# Altium schematic sheet 07.RK3399 Display.SchDoc
size A4; SheetNumber: 7; SheetTotal: 10
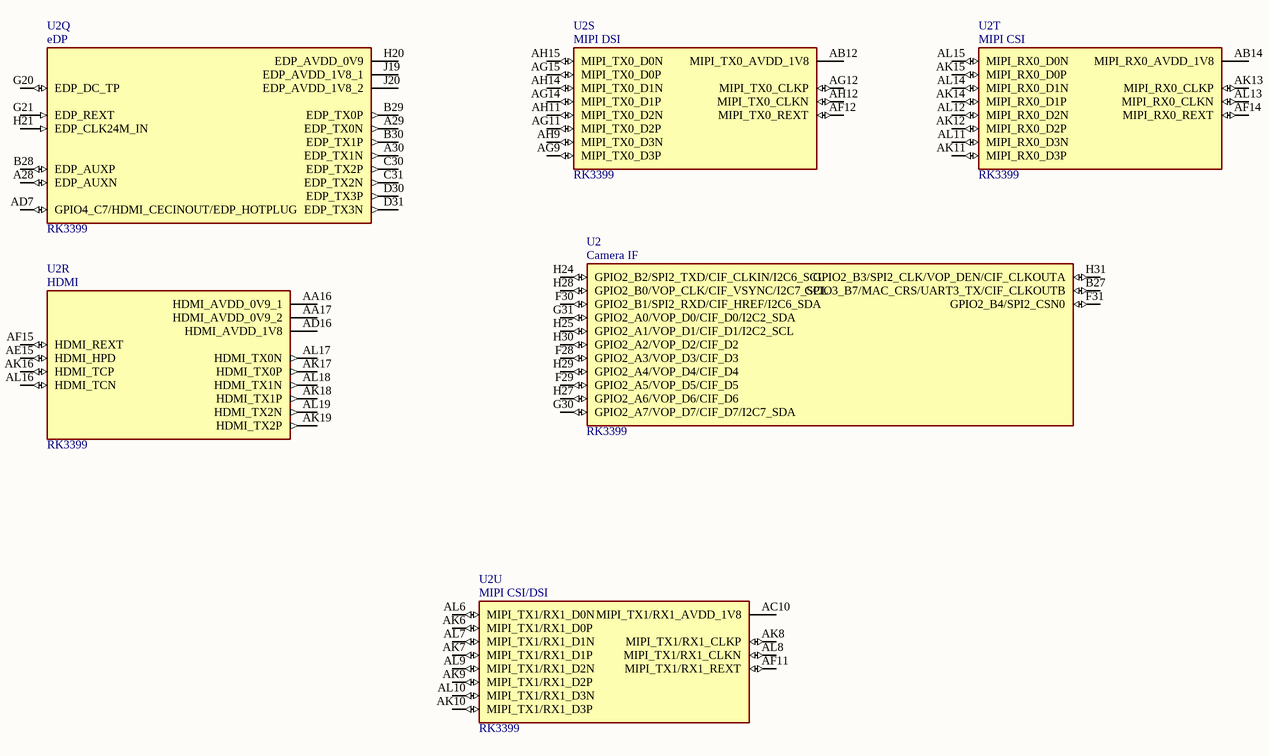
[diagram p0: 07.RK3399 Display.SchDoc]

## Parts
U2  RK3399  [BGA828C65P31X31_2100X2100X161N]  (parts Q,R,S,T,U,28 of 32)

## Nets

Not connected (* = marked no-connect by the designer): U2 A28(EDP_AUXN) A29(EDP_TX0N) A30(EDP_TX1N) AA16(HDMI_AVDD_0V9_1) AA17(HDMI_AVDD_0V9_2) AB12(MIPI_TX0_AVDD_1V8) AB14(MIPI_RX0_AVDD_1V8) AC10(MIPI_TX1/RX1_AVDD_1V8) AD7(GPIO4_C7/HDMI_CECINOUT/EDP_HOTPLUG) AD16(HDMI_AVDD_1V8) AE15(HDMI_HPD) AF11(MIPI_TX1/RX1_REXT) AF12(MIPI_TX0_REXT) AF14(MIPI_RX0_REXT) AF15(HDMI_REXT) AG9(MIPI_TX0_D3P) AG11(MIPI_TX0_D2P) AG12(MIPI_TX0_CLKP) AG14(MIPI_TX0_D1P) AG15(MIPI_TX0_D0P) AH9(MIPI_TX0_D3N) AH11(MIPI_TX0_D2N) AH12(MIPI_TX0_CLKN) AH14(MIPI_TX0_D1N) AH15(MIPI_TX0_D0N) AK6(MIPI_TX1/RX1_D0P) AK7(MIPI_TX1/RX1_D1P) AK8(MIPI_TX1/RX1_CLKP) AK9(MIPI_TX1/RX1_D2P) AK10(MIPI_TX1/RX1_D3P) AK11(MIPI_RX0_D3P) AK12(MIPI_RX0_D2P) AK13(MIPI_RX0_CLKP) AK14(MIPI_RX0_D1P) AK15(MIPI_RX0_D0P) AK16(HDMI_TCP) AK17(HDMI_TX0P) AK18(HDMI_TX1P) AK19(HDMI_TX2P) AL6(MIPI_TX1/RX1_D0N) AL7(MIPI_TX1/RX1_D1N) AL8(MIPI_TX1/RX1_CLKN) AL9(MIPI_TX1/RX1_D2N) AL10(MIPI_TX1/RX1_D3N) AL11(MIPI_RX0_D3N) AL12(MIPI_RX0_D2N) AL13(MIPI_RX0_CLKN) AL14(MIPI_RX0_D1N) AL15(MIPI_RX0_D0N) AL16(HDMI_TCN) AL17(HDMI_TX0N) AL18(HDMI_TX1N) AL19(HDMI_TX2N) B27(GPIO3_B7/MAC_CRS/UART3_TX/CIF_CLKOUTB) B28(EDP_AUXP) B29(EDP_TX0P) B30(EDP_TX1P) C30(EDP_TX2P) C31(EDP_TX2N) D30(EDP_TX3P) D31(EDP_TX3N) F28(GPIO2_A3/VOP_D3/CIF_D3) F29(GPIO2_A5/VOP_D5/CIF_D5) F30(GPIO2_B1/SPI2_RXD/CIF_HREF/I2C6_SDA) F31(GPIO2_B4/SPI2_CSN0) G20(EDP_DC_TP) G21(EDP_REXT) G30(GPIO2_A7/VOP_D7/CIF_D7/I2C7_SDA) G31(GPIO2_A0/VOP_D0/CIF_D0/I2C2_SDA) H20(EDP_AVDD_0V9) H21(EDP_CLK24M_IN) H24(GPIO2_B2/SPI2_TXD/CIF_CLKIN/I2C6_SCL) H25(GPIO2_A1/VOP_D1/CIF_D1/I2C2_SCL) H27(GPIO2_A6/VOP_D6/CIF_D6) H28(GPIO2_B0/VOP_CLK/CIF_VSYNC/I2C7_SCL) H29(GPIO2_A4/VOP_D4/CIF_D4) H30(GPIO2_A2/VOP_D2/CIF_D2) H31(GPIO2_B3/SPI2_CLK/VOP_DEN/CIF_CLKOUTA) J19(EDP_AVDD_1V8_1) J20(EDP_AVDD_1V8_2)

## Notes on the sheet
- (in symbol RK3399, part Q) eDP
- (in symbol RK3399, part R) HDMI
- (in symbol RK3399, part S) MIPI DSI
- (in symbol RK3399, part T) MIPI CSI
- (in symbol RK3399, part U) MIPI CSI/DSI
- (in symbol RK3399, part 28) Camera IF

## Library data of the parts
U2 = RK3399: RK3399 ROCK Pi 4 Model A 2GB - ARMÂ® CortexÂ®-A53, CortexÂ®-A72 MPU Embedded Evaluation Board; MF: Rockchip; SnapEDA_Link: https://www.snapeda.com/parts/RK3399/Fuzhou+Rockchip+Electronics+Co/view-part/?ref=snap; Package: Seeed Technology; MP: RK3399; Check_prices: https://www.snapeda.com/parts/RK3399/Fuzhou+Rockchip+Electronics+Co/view-part/?ref=eda; Price: None; Value: *; Availability: Not in stock